# Altium schematic sheet Z7_JTAG&DEBUG.SchDoc
size A3
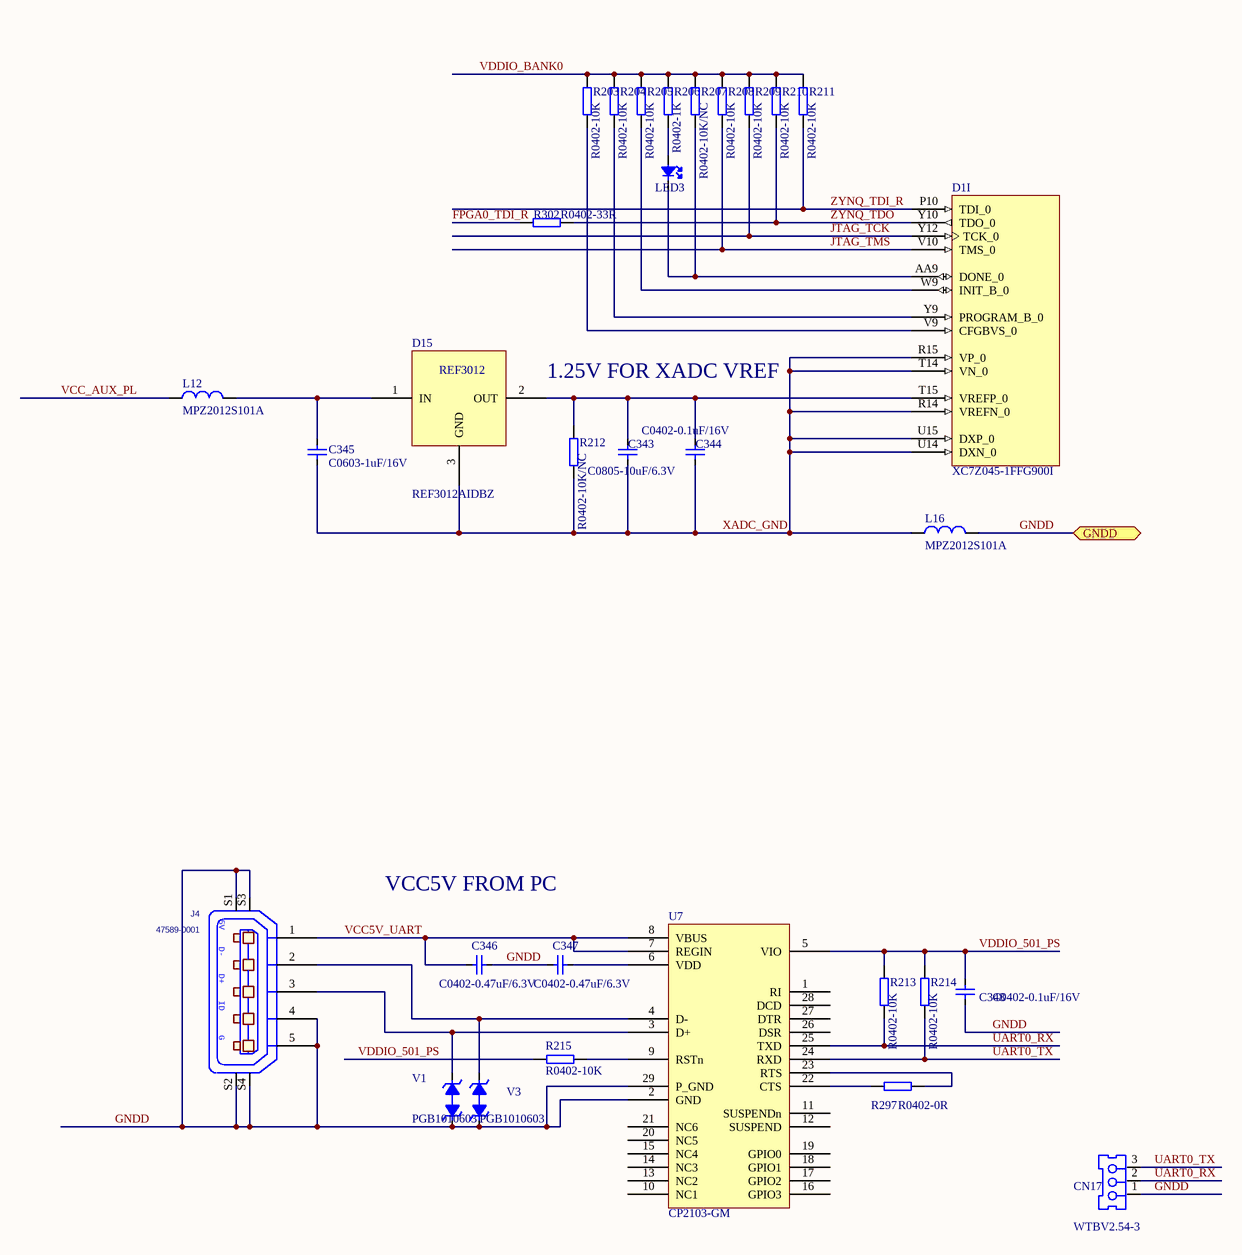
[diagram p0: Z7_JTAG&DEBUG.SchDoc]

## Parts
C343  C0805-10uF/6.3V  [C0805]
C344  C0402-0.1uF/16V  [C0402]
C345  C0603-1uF/16V  [C0603]
C346  C0402-0.47uF/6.3V  [C0402]
C347  C0402-0.47uF/6.3V  [C0402]
C348  C0402-0.1uF/16V  [C0402]
CN17  WTBV2.54-3  [WTB2.54-3V]
D1  XC7Z045-1FFG900I  [FFG900]  (part I of 16)
D15  REF3012AIDBZ  [SOT-23]
J4  47589-0001  [con5_microusb]
L12  MPZ2012S101A  [R0805]
L16  MPZ2012S101A  [R0805]
LED3  LED0603-GREEN  [LED-R0603]  (value not drawn)
R203  R0402-10K  [R0402]
R204  R0402-10K  [R0402]
R205  R0402-10K  [R0402]
R206  R0402-1K  [R0402]
R207  R0402-10K/NC  [R0402]
R208  R0402-10K  [R0402]
R209  R0402-10K  [R0402]
R210  R0402-10K  [R0402]
R211  R0402-10K  [R0402]
R212  R0402-10K/NC  [R0402]
R213  R0402-10K  [R0402]
R214  R0402-10K  [R0402]
R215  R0402-10K  [R0402]
R297  R0402-0R  [R0402]
R302  R0402-33R  [R0402]
U7  CP2103-GM  [QFN-28]
V1  PGB1010603  [R0603]
V3  PGB1010603  [R0603]

## Ports
GNDD

## Nets
FPGA0_TDI_R: R302.1
GNDD: C346.2 C347.1 C348.2 CN17.1 J4.4(P4) J4.5(P5) J4.S1(SHLD1) J4.S2(SHLD2) J4.S3(SHLD3) J4.S4(SHLD4) L16.2 U7.2(GND) U7.29(P_GND) V1.1(ANODE) V3.1(ANODE) ; port GNDD
JTAG_TCK: D1.Y12(TCK_0) R209.2
JTAG_TMS: D1.V10(TMS_0) R208.2
UART0_RX: CN17.2 R213.2 U7.25(TXD)
UART0_TX: CN17.3 R214.2 U7.24(RXD)
VCC5V_UART: C346.1 J4.1(P1) U7.7(REGIN) U7.8(VBUS)
VCC_AUX_PL: L12.1
VDDIO_501_PS: C348.1 R213.1 R214.1 R215.1 U7.5(VIO)
VDDIO_BANK0: R203.1 R204.1 R205.1 R206.1 R207.1 R208.1 R209.1 R210.1 R211.1
XADC_GND: C343.2 C344.2 C345.2 D1.R14(VREFN_0) D1.R15(VP_0) D1.T14(VN_0) D1.U14(DXN_0) D1.U15(DXP_0) D15.3(GND) L16.1 R212.2
ZYNQ_TDI_R: D1.P10(TDI_0) R211.2
ZYNQ_TDO: D1.Y10(TDO_0) R210.2 R302.2
NetC343_1: C343.1 C344.1 D1.T15(VREFP_0) D15.2(OUT) R212.1
NetC345_1: C345.1 D15.1(IN) L12.2
NetC347_2: C347.2 U7.6(VDD)
NetD1_AA9: D1.AA9(DONE_0) LED3.2(K) R207.2
NetD1_V9: D1.V9(CFGBVS_0) R203.2
NetD1_W9: D1.W9(INIT_B_0) R205.2
NetD1_Y9: D1.Y9(PROGRAM_B_0) R204.2
NetJ4_2: J4.2(P2) U7.4(D-) V3.2(CATHODE)
NetJ4_3: J4.3(P3) U7.3(D+) V1.2(CATHODE)
NetLED3_1: LED3.1(A) R206.2
NetR215_2: R215.2 U7.9(RSTn)
NetR297_1: R297.1 U7.22(CTS)
NetR297_2: R297.2 U7.23(RTS)

Not connected (* = marked no-connect by the designer): U7 1(RI) 10(NC1) 11(SUSPENDn) 12(SUSPEND) 13(NC2) 14(NC3) 15(NC4) 16(GPIO3) 17(GPIO2) 18(GPIO1) 19(GPIO0) 20(NC5) 21(NC6) 26(DSR) 27(DTR) 28(DCD)

## Notes on the sheet
- 1.25V FOR XADC VREF
- VCC5V FROM PC
- (in symbol USB_MINI_AB_RECEPTACLE) 5V; D-; D+; ID; G

## Library data of the parts
C343 = C1210-22uF/16V: Part_number: C0805-10uF/6.3V; Part_type: CAP; Value: C0805-10uF/6.3V; Schematic_Part: CAP; PCB_Footprint: C0805
C344 C346-C348 = C0402-0.1uF/16V: X7R; Manufacturer: SAMSUNG; Manufacturer_p/n: CL05X7R104KO5NNN; Part_type: CAP; temperature: -55℃\+125℃; Schematic_Part: CAP; PCB_Footprint: C0402; datasheet: #DataSheet\C_Samsung_General Capacitors.pdf#
  C344 C348: Part_number: C0402-0.1uF/16V; Value: C0402-0.1uF/16V
  C346 C347: Part_number: C0402-0.47uF/6.3V; Value: C0402-0.47uF/6.3V
C345 = C0603-100nF/16V: X7R; Part_number: C0603-1uF/16V; Part_type: CAP; Value: C0603-1uF/16V; temperature: -55℃\+125℃; Schematic_Part: CAP; PCB_Footprint: C0603
CN17 = WTBV2_0.54-3
D1 = XC7Z045-1FFG900I: 667 MHz Zynq?7000 AP SoC, 130 PS I/O, 378 FPGA I/O, 900-Ball BGA, Speed Grade 1, Industrial Grade, Pb-Free; Manufacturer: Xilinx; Extensible Block RAM (# 36Kb Blocks): 2180 KB (545); Flip Flops: 437200; LUTs: 218600; Speed Grade: -1; DatasheetVersion: v1.2; PackageVersion: Rev 1.1; PackageReference: FFG900; PackageDescription: Flip-Chip BGA, Body 31 x 31 mm, 1.0 mm Pitch; Generic Part Number: XC7Z045; RoHS: Pb-Free; Mounting Technology: Surface Mount; Code_JEDEC: MS-034-AAN-1; PartNumber: XC7Z045-1FFG900I; ComponentLink1Description: Datasheet; ComponentLink1URL: http://www.xilinx.com/support/documentation/data_sheets/ds190-Zynq-7000-Overview.pdf; ComponentLink2Description: Package Specification; ComponentLink2URL: http://www.xilinx.com/support/documentation/user_guides/ug865-Zynq-7000-Pkg-Pinout.pdf; ComponentLink3Description: DC and AC Switching Characteristics; ComponentLink3URL: http://www.xilinx.com/support/documentation/data_sheets/ds191-XC7Z030-XC7Z045-data-sheet.pdf; ComponentLink4Description: Package File; ComponentLink4URL: http://www.xilinx.com/support/packagefiles/z7packages/xc7z045ffg900pkg.txt; ComponentLink5Description: Packaging and Pinout; ComponentLink5URL: http://www.xilinx.com/support/documentation/user_guides/ug865-Zynq-7000-Pkg-Pinout.pdf; ComponentLink6Description: PCB and Layout Guide; ComponentLink6URL: http://www.xilinx.com/support/documentation/user_guides/ug483_7Series_PCB.pdf
J4 = USB_MINI_AB_RECEPTACLE: MOLEX MICRO USB AB 5; CLASS: IO; FPLIST: con5_microusb,con5_microusb_cust; CAD_APPROVED: Yes; DESCRIPTION: CON 1X5 USB_MICRO_AB_RECEPTACLE RA SMT 0.65MM SP 105H AU; AGILE_PN: 211-78722; HEIGHT: 2.65MM; ROHS: Yes; MFG_PN01: 47589-0001; MFG_NAME01: Molex
L12 L16 = FB0805-330R@100MHz: Manufacturer: TDK; Part_number: MPZ2012S101A; Part_type: BEAD; temperature: -55℃\+125℃; Value1: 330R@100MHz; Schematic_Part: BEAD; PCB_Footprint: R0805; Manufacturer_p/n: MPZ2012S101A
LED3 = LED-R_3: 表贴发光二极管, 0603封装, 体积1.6x0.8mm, 绿色, 高度0.8mm; Part_number: LED0603-GREEN
R203-R215 R297 R302 = R0402-10K: Manufacturer: SAMSUNG; Part_type: RES; Schematic_Part: RES; PCB_Footprint: R0402
  R203-R205 R208-R211 R213-R215: Part_number: R0402-10K; Value: R0402-10K
  R206: Part_number: R0402-1K; Value: R0402-1K
  R207 R212: Part_number: R0402-10K/NC; Value: R0402-10K/NC
  R297: Part_number: R0402-0R; Value: R0402-0R
  R302: Part_number: R0402-33R; Value: R0402-33R
U7 = CP2103: Part_number: CP2103-GM
V1 V3 = PGB1010603: U_Protector_PGB1 Series Lead-Free 0603 Surface Mount ESD Suppressor_PGB1010603_SMT_SOCM-1608_L1.6×W0.78×H0.35mm; Manufacturer: Littelfuse; Designer: WHG; Manufacturer Part Number: PGB1010603; Design Date: 2016.3.24; Value: PGB1010603
D15 = REF3012AIDBZ: Part_number: REF3012AIDBZ